# Altium schematic sheet investigator_oring.SchDoc
size Letter
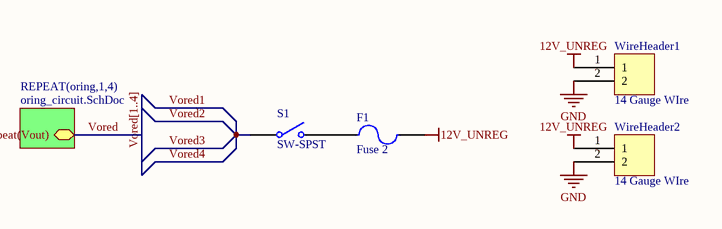
[diagram p0: investigator_oring.SchDoc]

## Parts
F1  Fuse 2  [FUSE]
S1  SW-SPST  [switch]
WireHeader1  14 Gauge WIre  [WireHeader]
WireHeader2  14 Gauge WIre  [WireHeader]

## Sub-sheets
REPEAT(oring,1,4) = oring_circuit.SchDoc: Repeat(Vout)

## Nets
12V_UNREG: F1.2 WireHeader1.1 WireHeader2.1
GND: WireHeader1.2 WireHeader2.2
Vored: sheet REPEAT(oring,1,4)/Repeat(Vout)
Vored1: S1.1(COMMON)  [also labelled Vored2, Vored3, Vored4]
NetF1_1: F1.1 S1.2(NO)

## Buses and harness runs
bus Vored[1..4]

## Library data of the parts
F1 = Fuse 2: Fuse; Published: 8-Jun-2000; LatestRevisionDate: 17-Jul-2002; LatestRevisionNote: Re-released for DXP Platform.; PackageReference: PIN-W2/E2.8; Publisher: Altium Limited; PackageDescription: Thru-Hole; 2 Leads
S1 = SW-SPST: Single-Pole, Single-Throw Switch; Published: 24-Mar-1999; LatestRevisionDate: 17-Jul-2002; LatestRevisionNote: Re-released for DXP Platform.; PackageReference: SPST-2; Publisher: Altium Limited; PackageDescription: Switch; 2 Leads
WireHeader1 WireHeader2 = WireHeader